# EAGLE schematic communications_hub2 (EAGLE 9.4.0)
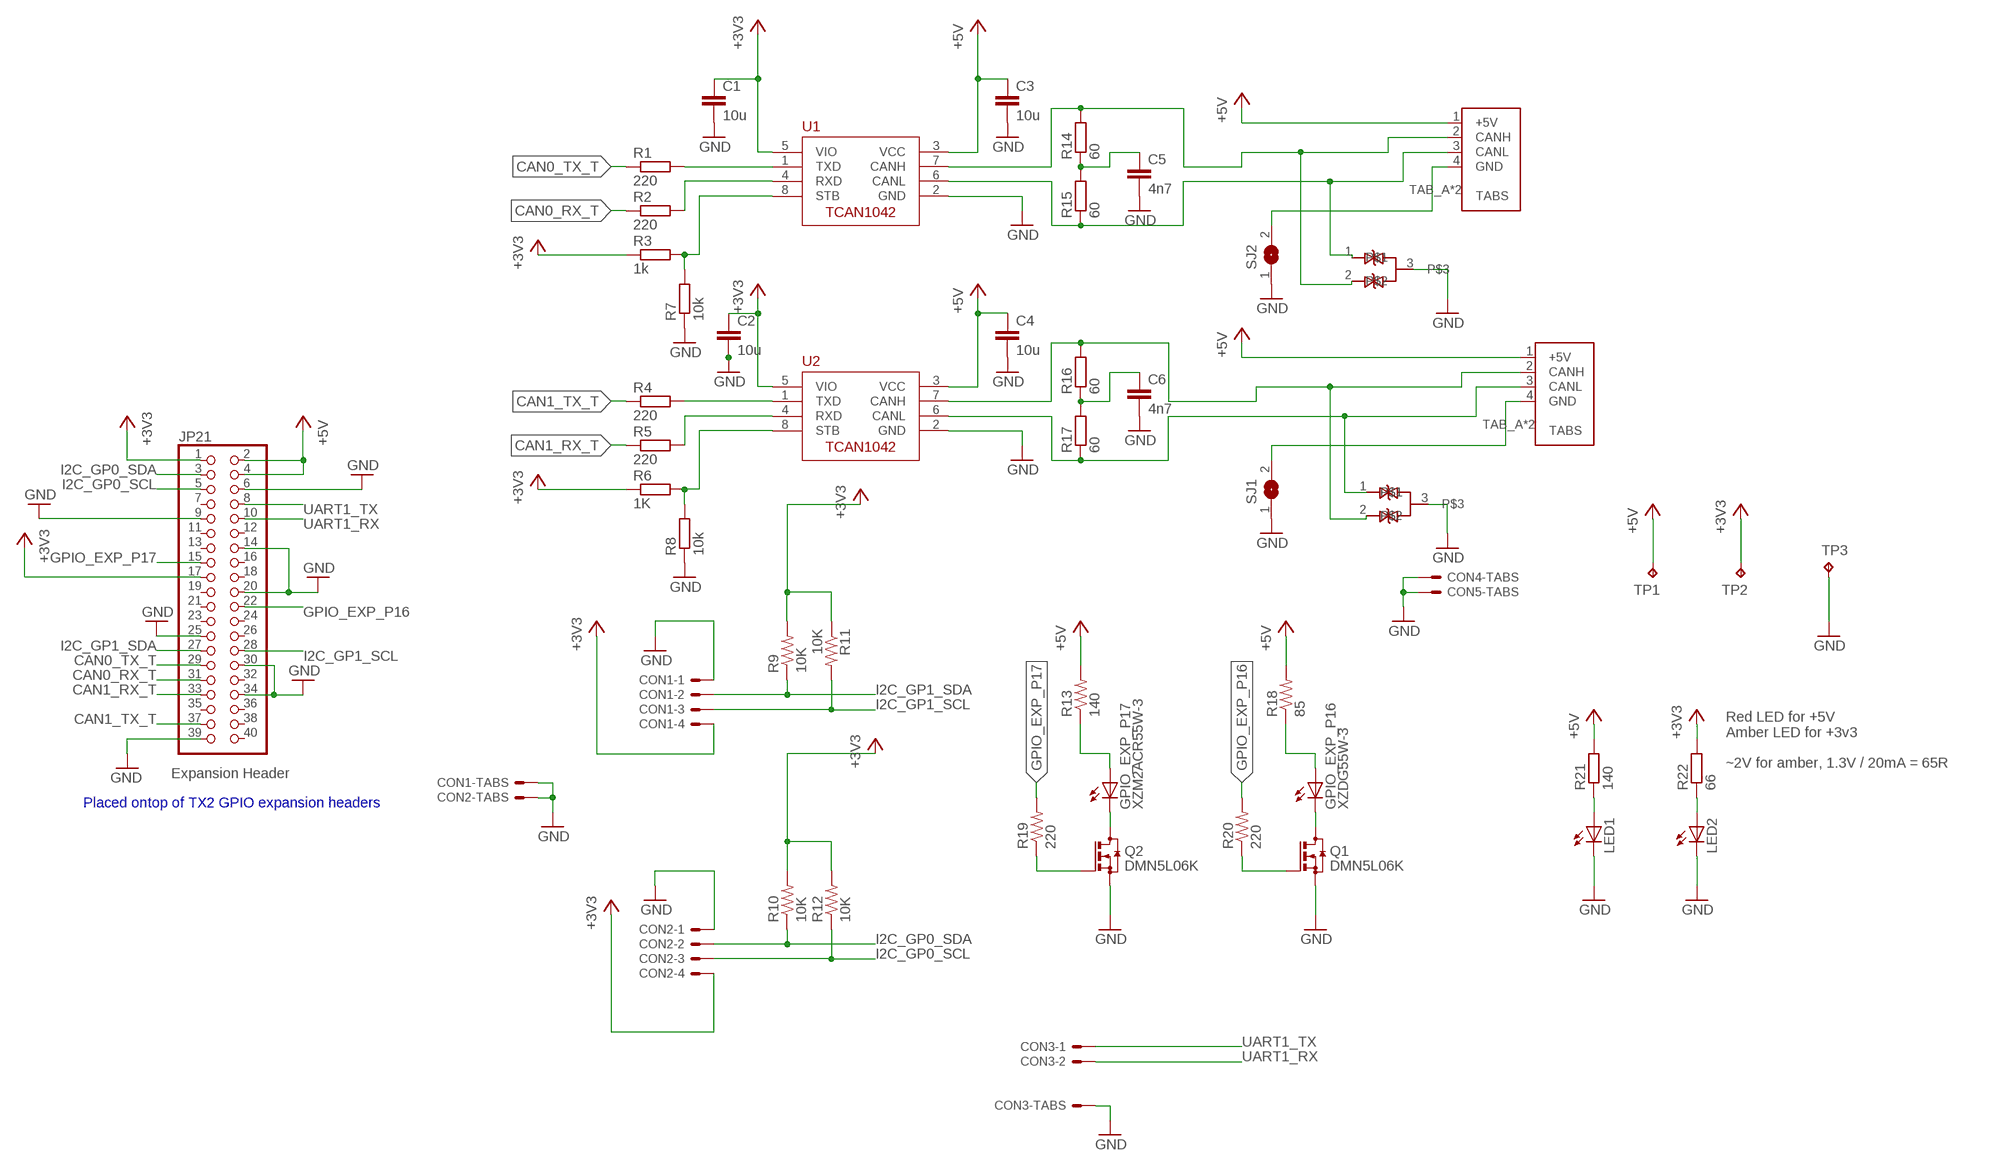
[diagram p0: schematic, sheet 1]

## Parts
C1  10u  C-EUC0805  [C0805]
C2  10u  C-EUC0805  [C0805]
C3  10u  C-EUC0805  [C0805]
C4  10u  C-EUC0805  [C0805]
C5  4n7  C-EUC0805  [C0805]
C6  4n7  C-EUC0805  [C0805]
CON1  SM04B-GHS-TB  [SM04B-GHS-TB]
CON2  SM04B-GHS-TB  [SM04B-GHS-TB]
CON3  SM02B-GHS-TB  [SM02B-GHS-TB]
CON4  SM04B-GHS-TB  [SM04B-GHS-TB]
CON5  SM04B-GHS-TB  [SM04B-GHS-TB]
CON6  UAVCAN_MICRO  [SM04B-GHS-TB]
CON7  UAVCAN_MICRO  [SM04B-GHS-TB]
GPIO_EXP_P16  XZDG55W-3  LED_E  [LED_1206]
GPIO_EXP_P17  XZM2ACR55W-3  LED_E  [LED_1206]
JP21  PINHD-2X20  [2X20]
LED1  LEDSMT1206  [1206]
LED2  LEDSMT1206  [1206]
Q1  DMN5L06K  BSS123  [SOT23]
Q2  DMN5L06K  BSS123  [SOT23]
R1  220  R-EU_R0805  [R0805]
R2  220  R-EU_R0805  [R0805]
R3  1k  R-EU_R0805  [R0805]
R4  220  R-EU_R0805  [R0805]
R5  220  R-EU_R0805  [R0805]
R6  1K  R-EU_R0805  [R0805]
R7  10k  R-EU_R0805  [R0805]
R8  10k  R-EU_R0805  [R0805]
R9  10K  R-US_M1206  [M1206]
R10  10K  R-US_M1206  [M1206]
R11  10K  R-US_M1206  [M1206]
R12  10K  R-US_M1206  [M1206]
R13  140  R-US_M1206  [M1206]
R14  60  R-EU_R1206  [R1206]
R15  60  R-EU_R1206  [R1206]
R16  60  R-EU_R1206  [R1206]
R17  60  R-EU_R1206  [R1206]
R18  85  R-US_M1206  [M1206]
R19  220  R-US_R0805  [R0805]
R20  220  R-US_R0805  [R0805]
R21  140  R-EU_R0805  [R0805]
R22  66  R-EU_R0805  [R0805]
SJ1  SJ  [SJ]
SJ2  SJ  [SJ]
TP1  TPB2,54  [B2,54]
TP2  TPB2,54  [B2,54]
TP3  TPB2,54  [B2,54]
U1  TCAN1042HVDR  [SO-8]
U2  TCAN1042HVDR  [SO-8]
U$4  NUP2105L  [SOT23]
U$5  NUP2105L  [SOT23]

## Nets
+3V3: C1.1 C2.1 CON1.P$4 CON2.P$4 JP21.1 JP21.17 R3.1 R6.1 R9.2 R10.2 R11.1 R12.2 R22.2 TP2.TP U1.5(VIO) U2.5(VIO)
+5V: C3.1 C4.1 CON6.1(+5V) CON7.1(+5V) JP21.2 JP21.4 R13.2 R18.2 R21.2 TP1.TP U1.3(VCC) U2.3(VCC)
CAN0_RX_T: JP21.31 R2.1
CAN0_TX_T: JP21.29 R1.1
CAN1_RX_T: JP21.33 R5.1
CAN1_TX_T: JP21.37 R4.1
GND: C1.2 C2.2 C3.2 C4.2 C5.2 C6.2 CON1.P$1 CON1.P$5 CON1.P$6 CON2.P$1 CON2.P$5 CON2.P$6 CON3.P$3 CON3.P$4 CON4.P$5 CON4.P$6 CON5.P$5 CON5.P$6 JP21.6 JP21.9 JP21.14 JP21.20 JP21.25 JP21.30 JP21.34 JP21.39 LED1.C LED2.C Q1.2(S) Q2.2(S) R7.1 R8.1 SJ1.1 SJ2.1 TP3.TP U1.2(GND) U2.2(GND) U$4.3 U$5.3
GPIO_EXP_P16: JP21.22 R20.2
GPIO_EXP_P17: JP21.15 R19.2
I2C_GP0_SCL: CON2.P$3 JP21.5 R12.1
I2C_GP0_SDA: CON2.P$2 JP21.3 R10.1
I2C_GP1_SCL: CON1.P$3 JP21.28 R11.2
I2C_GP1_SDA: CON1.P$2 JP21.27 R9.1
N$3: GPIO_EXP_P17.A R13.1
N$4: GPIO_EXP_P16.A R18.1
N$7: CON7.4(GND) SJ1.2
N$8: CON6.4(GND) SJ2.2
N$9: GPIO_EXP_P17.C Q2.3(D)
N$10: GPIO_EXP_P16.C Q1.3(D)
N$11: Q2.1(G) R19.1
N$12: Q1.1(G) R20.1
N$13: LED1.A R21.1
N$14: LED2.A R22.1
N$19: C5.1 R14.1 R15.2
N$20: C6.1 R16.1 R17.2
N$21: CON7.2(CANH) R16.2 U2.7(CANH) U$5.2
N$22: CON7.3(CANL) R17.1 U2.6(CANL) U$5.1
N$23: CON6.2(CANH) R14.2 U1.7(CANH) U$4.2
N$24: CON6.3(CANL) R15.1 U1.6(CANL) U$4.1
N$25: R1.2 U1.1(TXD)
N$26: R2.2 U1.4(RXD)
N$27: R3.2 R7.2 U1.8(STB)
N$28: R4.2 U2.1(TXD)
N$29: R5.2 U2.4(RXD)
N$30: R6.2 R8.2 U2.8(STB)
UART1_RX: CON3.P$2 JP21.10
UART1_TX: CON3.P$1 JP21.8
Unconnected: CON4.P$1 CON4.P$2 CON4.P$3 CON4.P$4 CON5.P$1 CON5.P$2 CON5.P$3 CON5.P$4 CON6.TAB_A(TABS) CON6.TAB_B(TABS) CON7.TAB_A(TABS) CON7.TAB_B(TABS) JP21.7 JP21.11 JP21.12 JP21.13 JP21.16 JP21.18 JP21.19 JP21.21 JP21.23 JP21.24 JP21.26 JP21.32 JP21.35 JP21.36 JP21.38 JP21.40

## Notes on the sheet
- Expansion Header
- Red LED for +5V
  Amber LED for +3v3
  
  ~2V for amber, 1.3V / 20mA = 65R
- Placed ontop of TX2 GPIO expansion headers

## Library data of the parts
C1-C6 = resistor:C-EU: CAPACITOR, European symbol
CON1 CON2 CON4 CON5 = ARVP:SM04B-GHS-TB
CON3 = ARVP:SM02B-GHS-TB
CON6 CON7 = SPEAR-general:UAVCAN_MICRO: CAN Bus Standard Connector
GPIO_EXP_P16 GPIO_EXP_P17 = eagle-ltspice:LED_E: LED Source: http://www.osram.convergy.de Source: www.luxeon.com Source: www.kingbright.com; SPICEMODEL: NONE; SPICEPREFIX: D; SPICETYPE: diode
JP21 = commhub:PINHD-2X20: PIN HEADER
LED1 LED2 = led:LED: LED OSRAM: - CHIPLED LG R971, LG N971, LY N971, LG Q971, LY Q971, LO R971, LY R971 LH N974, LH R974 LS Q976, LO Q976, LY Q976 LO Q996 - Hyper CHIPLED LW Q18S LB Q993, LB Q99A, LB R99A - SideLED LS A670, LO A670, LY A670, LG A670, LP A670 LB A673, LV A673, LT A673, LW A673 LH A674 LY A675 LS A676, LA A676, LO A676, LY A676, LW A676 LS A679, LY A679, LG A679 - Hyper Micro SIDELED® LS Y876, LA Y876, LO Y876, LY Y876 LT Y87S - SmartLED LW L88C, LW L88S LB L89C, LB L89S, LG L890 LS L89K, LO L89K, LY L89K LS L896, LA L896, LO L896, LY L896 - TOPLED LS T670, LO T670, LY T670, LG T670, LP T670 LSG T670, LSP T670, LSY T670, LOP T670, LYG T670 LG T671, LOG T671, LSG T671 LB T673, LV T673, LT T673, LW T673 LH T674 LS T676, LA T676, LO T676, LY T676, LB T676, LH T676, LSB T676, LW T676 LB T67C, LV T67C, LT T67C, LS T67K, LO T67K, LY T67K, LW E67C LS E67B, LA E67B, LO E67B, LY E67B, LB E67C, LV E67C, LT E67C LW T67C LS T679, LY T679, LG T679 LS T770, LO T770, LY T770, LG T770, LP T770 LB T773, LV T773, LT T773, LW T773 LH T774 LS E675, LA E675, LY E675, LS T675 LS T776, LA T776, LO T776, LY T776, LB T776 LHGB T686 LT T68C, LB T68C - Hyper Mini TOPLED® LB M676 - Mini TOPLED Santana® LG M470 LS M47K, LO M47K, LY M47K Source: http://www.osram.convergy.de LUXEON: - LUMILED® LXK2-PW12-R00, LXK2-PW12-S00, LXK2-PW14-U00, LXK2-PW14-V00 LXK2-PM12-R00, LXK2-PM12-S00, LXK2-PM14-U00 LXK2-PE12-Q00, LXK2-PE12-R00, LXK2-PE12-S00, LXK2-PE14-T00, LXK2-PE14-U00 LXK2-PB12-K00, LXK2-PB12-L00, LXK2-PB12-M00, LXK2-PB14-N00, LXK2-PB14-P00, LXK2-PB14-Q00 LXK2-PR12-L00, LXK2-PR12-M00, LXK2-PR14-Q00, LXK2-PR14-R00 LXK2-PD12-Q00, LXK2-PD12-R00, LXK2-PD12-S00 LXK2-PH12-R00, LXK2-PH12-S00 LXK2-PL12-P00, LXK2-PL12-Q00, LXK2-PL12-R00 Source: www.luxeon.com KINGBRIGHT: KA-3528ASYC Source: www.kingbright.com
Q1 Q2 = transistor-small-signal:BSS123: N-CHANNEL MOS FET
R1-R8 R14-R17 R21 R22 = resistor:R-EU_: RESISTOR, European symbol
R9-R13 R18 = resistor:R-US_: RESISTOR, American symbol
R19 R20 = rcl:R-US_: RESISTOR, American symbol
SJ1 SJ2 = jumper:SJ: SMD solder JUMPER
TP1-TP3 = testpad:TP: Test pad
U1 U2 = ARVP:TCAN1042HVDR
U$4 U$5 = ARVP:NUP2105L